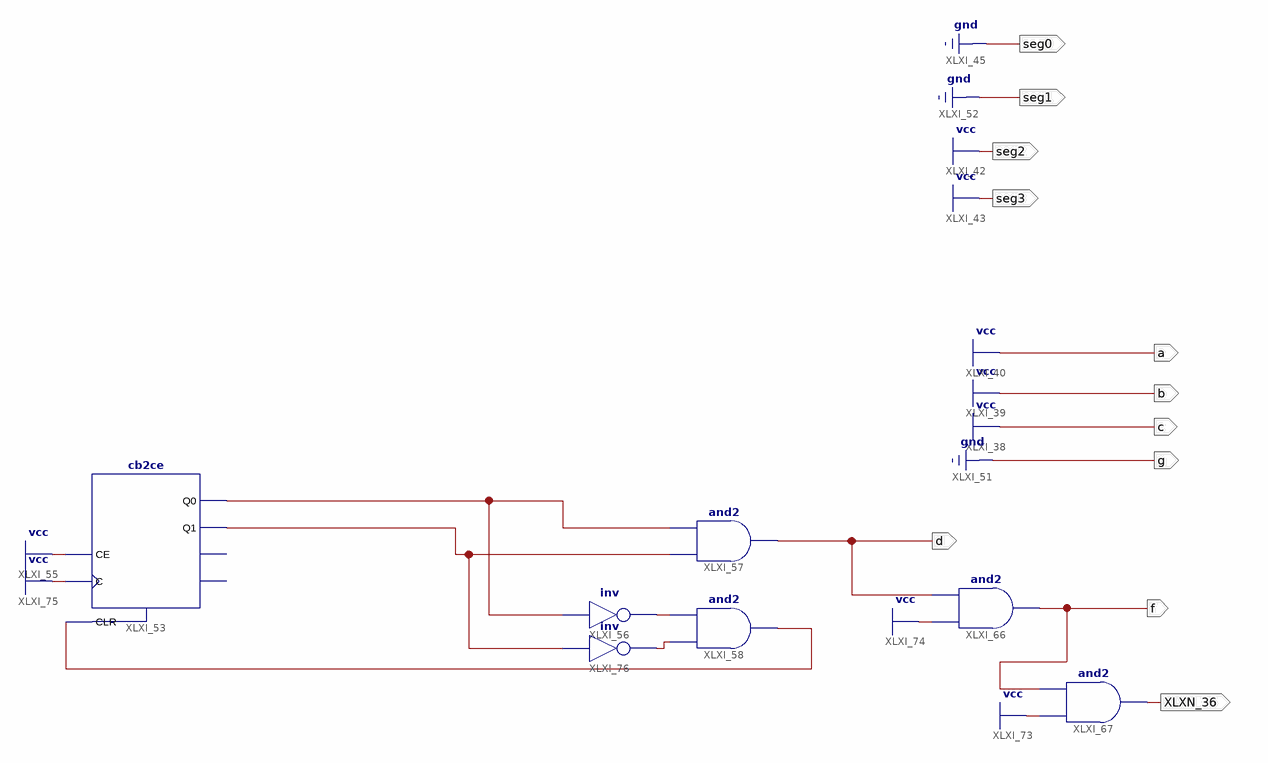
[diagram p0: schematic sheet 1]
// Xilinx ISE schematic main.sch (spartan6) as structural Verilog: 7 symbols, 11 ports
module main (
  output seg0,
  output seg1,
  output seg2,
  output seg3,
  output c,
  output b,
  output a,
  output g,
  output f,
  output d,
  output XLXN_36
);

  wire XLXN_26, XLXN_27, XLXN_28, XLXN_29, XLXN_39;

  cb2ce XLXI_53 (.C(1'b1), .CE(1'b1), .CLR(XLXN_26), .Q0(XLXN_28), .Q1(XLXN_29));  // open: CEO, TC
  not XLXI_56 (XLXN_27, XLXN_28);
  and XLXI_58 (XLXN_26, XLXN_39, XLXN_27);
  and XLXI_57 (d, XLXN_29, XLXN_28);
  and XLXI_66 (f, 1'b1, d);
  and XLXI_67 (XLXN_36, 1'b1, f);
  not XLXI_76 (XLXN_39, XLXN_29);

  assign a = 1'b1;
  assign b = 1'b1;
  assign c = 1'b1;
  assign g = 1'b0;
  assign seg0 = 1'b0;
  assign seg1 = 1'b0;
  assign seg2 = 1'b1;
  assign seg3 = 1'b1;
endmodule
